# EAGLE design Sheep (EAGLE 7.3.0)
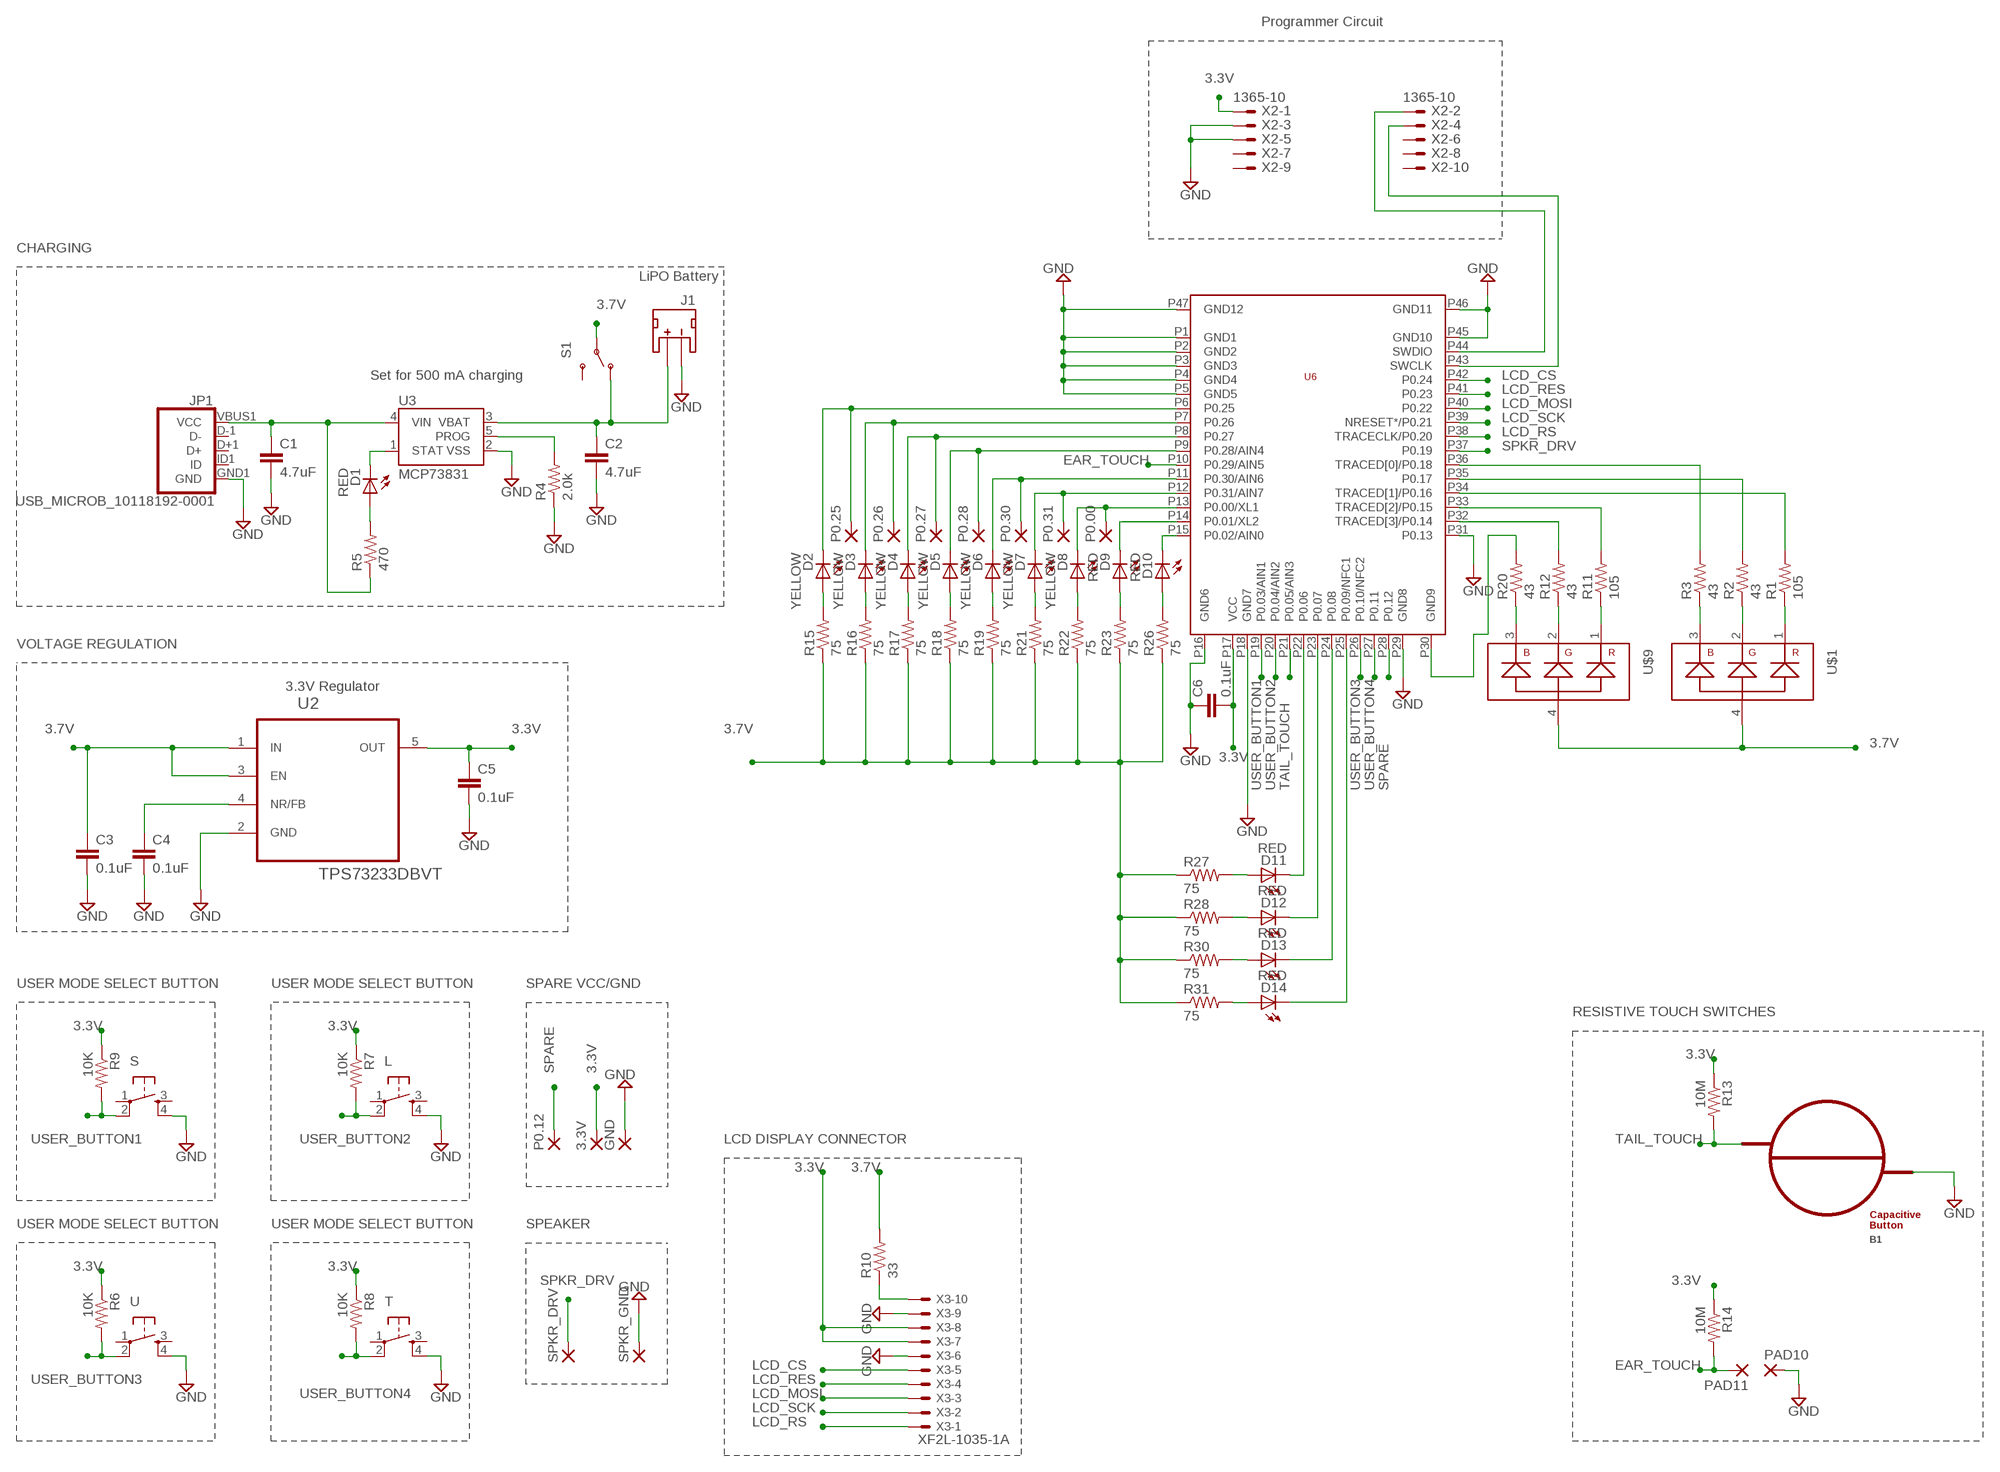
[diagram p0: schematic, sheet 1]

## Parts
3.3V  1,6/0,8  [1,6/0,8]
B1  BUTTON_ACTIVE_DUAL  [BUTTON_ACTIVE_DUAL_10MM]
C1  4.7uF  CAP0603-CAP  [0603-CAP]
C2  4.7uF  CAP0603-CAP  [0603-CAP]
C3  0.1uF  C-EUC0201  [C0201]
C4  0.1uF  C-EUC0201  [C0201]
C5  0.1uF  C-EUC0201  [C0201]
C6  0.1uF  C-EUC0201  [C0201]
D1  RED  LEDCHIP-LED0603  [CHIP-LED0603]
D2  YELLOW  LEDCHIP-LED0603  [CHIP-LED0603]
D3  YELLOW  LEDCHIP-LED0603  [CHIP-LED0603]
D4  YELLOW  LEDCHIP-LED0603  [CHIP-LED0603]
D5  YELLOW  LEDCHIP-LED0603  [CHIP-LED0603]
D6  YELLOW  LEDCHIP-LED0603  [CHIP-LED0603]
D7  YELLOW  LEDCHIP-LED0603  [CHIP-LED0603]
D8  YELLOW  LEDCHIP-LED0603  [CHIP-LED0603]
D9  RED  LEDCHIP-LED0603  [CHIP-LED0603]
D10  RED  LEDCHIP-LED0603  [CHIP-LED0603]
D11  RED  LEDCHIP-LED0603  [CHIP-LED0603]
D12  RED  LEDCHIP-LED0603  [CHIP-LED0603]
D13  RED  LEDCHIP-LED0603  [CHIP-LED0603]
D14  RED  LEDCHIP-LED0603  [CHIP-LED0603]
GND  1,6/0,8  [1,6/0,8]
J1  JST_2MM_MALE  [JST-2-SMD]
JP1  USB_MICROB_10118192-0001  USB_MICROB_PLUGCONN-11752  [USB-B-MICRO-SMD_V03]
L  DTSM-6  [DTSM-6]
P0.00  1,6/0,8  [1,6/0,8]
P0.12  1,6/0,8  [1,6/0,8]
P0.25  1,6/0,8  [1,6/0,8]
P0.26  1,6/0,8  [1,6/0,8]
P0.27  1,6/0,8  [1,6/0,8]
P0.28  1,6/0,8  [1,6/0,8]
P0.30  1,6/0,8  [1,6/0,8]
P0.31  1,6/0,8  [1,6/0,8]
PAD10  SMD5  [SMD2,54-5,08]
PAD11  SMD5  [SMD2,54-5,08]
R1  105  R-US_R0201  [R0201]
R2  43  R-US_R0201  [R0201]
R3  43  R-US_R0201  [R0201]
R4  2.0k  R-US_R0201  [R0201]
R5  470  R-US_R0201  [R0201]
R6  10K  R-US_R0201  [R0201]
R7  10K  R-US_R0201  [R0201]
R8  10K  R-US_R0201  [R0201]
R9  10K  R-US_R0201  [R0201]
R10  33  R-US_R0201  [R0201]
R11  105  R-US_R0201  [R0201]
R12  43  R-US_R0201  [R0201]
R13  10M  R-US_R0201  [R0201]
R14  10M  R-US_R0201  [R0201]
R15  75  R-US_R0201  [R0201]
R16  75  R-US_R0201  [R0201]
R17  75  R-US_R0201  [R0201]
R18  75  R-US_R0201  [R0201]
R19  75  R-US_R0201  [R0201]
R20  43  R-US_R0201  [R0201]
R21  75  R-US_R0201  [R0201]
R22  75  R-US_R0201  [R0201]
R23  75  R-US_R0201  [R0201]
R26  75  R-US_R0201  [R0201]
R27  75  R-US_R0201  [R0201]
R28  75  R-US_R0201  [R0201]
R30  75  R-US_R0201  [R0201]
R31  75  R-US_R0201  [R0201]
S  DTSM-6  [DTSM-6]
S1  SWITCH-SPDTSMD2  [SWITCH-SPDT-SMD]
SPKR_DRV  1,6/0,8  [1,6/0,8]
SPKR_GND  1,6/0,8  [1,6/0,8]
T  DTSM-6  [DTSM-6]
U  DTSM-6  [DTSM-6]
U2  TPS73233DBVT  [SOT95P280X145-5N]
U3  MCP73831  [SOT23-5]
U6  BMD-300  [BMD-300]
U$1  RGB  [0606]
U$9  RGB  [0606]
X2  1365-10  [1365-10]
X3  XF2L-1035-1A  52745-1090  [52745-1090]

## Nets
3.3V: 3.3V.1(P) C5.1 C6.2 R6.1 R7.1 R8.1 R9.1 R13.1 R14.1 U2.5(OUT) U6.P17(VCC) X2.1 X3.7 X3.8
3.7V: C3.1 R10.2 R15.1 R16.1 R17.1 R18.1 R19.1 R21.1 R22.1 R23.1 R26.1 R27.1 R28.1 R30.1 R31.1 S1.2(P) U2.1(IN) U2.3(EN) U$1.4 U$9.4
5.0V: C1.1 JP1.VBUS1(VCC) R5.1 U3.4(VIN)
EAR_TOUCH: PAD11.1(P) R14.2 U6.P10(P0.29/AIN5)
GND: B1.Q1 C1.2 C2.2 C3.2 C4.2 C5.2 C6.1 GND.1(P) J1.1(-) JP1.GND1(GND) L.4 PAD10.1(P) R4.1 S.4 SPKR_GND.1(P) T.4 U2.2(GND) U3.2(VSS) U6.P1(GND1) U6.P2(GND2) U6.P3(GND3) U6.P4(GND4) U6.P5(GND5) U6.P16(GND6) U6.P18(GND7) U6.P29(GND8) U6.P31(P0.13) U6.P45(GND10) U6.P46(GND11) U6.P47(GND12) U.4 X2.3 X2.5 X3.6 X3.9
LCD_CS: U6.P42(P0.24) X3.5
LCD_MOSI: U6.P40(P0.22) X3.3
LCD_RES: U6.P41(P0.23) X3.4
LCD_RS: U6.P38(TRACECLK/P0.20) X3.1
LCD_SCK: U6.P39(NRESET*/P0.21) X3.2
N$2: R2.2 U6.P35(P0.17)
N$3: R3.2 U6.P36(TRACED[0]/P0.18)
N$4: R11.2 U6.P33(TRACED[2]/P0.15)
N$5: D6.C P0.30.1(P) U6.P11(P0.30/AIN6)
N$6: D2.C P0.25.1(P) U6.P6(P0.25)
N$7: U6.P44(SWDIO) X2.2
N$8: R20.2 U6.P30(GND9)
N$9: D11.C U6.P22(P0.06)
N$10: D12.C U6.P23(P0.07)
N$11: U6.P43(SWCLK) X2.4
N$12: R1.2 U6.P34(TRACED[1]/P0.16)
N$15: R1.1 U$1.1
N$16: R2.1 U$1.2
N$17: R3.1 U$1.3
N$18: D3.C P0.26.1(P) U6.P7(P0.26)
N$20: D13.C U6.P24(P0.08)
N$21: D5.C P0.28.1(P) U6.P9(P0.28/AIN4)
N$22: D7.C P0.31.1(P) U6.P12(P0.31/AIN7)
N$23: D8.C P0.00.1(P) U6.P13(P0.00/XL1)
N$24: D9.C U6.P14(P0.01/XL2)
N$25: D10.C U6.P15(P0.02/AIN0)
N$26: D14.C U6.P25(P0.09/NFC1)
N$27: R12.2 U6.P32(TRACED[3]/P0.14)
N$28: R4.2 U3.5(PROG)
N$30: D11.A R27.2
N$31: D12.A R28.2
N$32: D13.A R30.2
N$33: D14.A R31.2
N$34: R10.1 X3.10
N$35: D1.A R5.2
N$36: D1.C U3.1(STAT)
N$39: R11.1 U$9.1
N$41: R12.1 U$9.2
N$42: D2.A R15.2
N$43: D3.A R16.2
N$44: D4.A R17.2
N$45: D5.A R18.2
N$46: D6.A R19.2
N$47: D7.A R21.2
N$48: D8.A R22.2
N$49: C4.1 U2.4(NR/FB)
N$50: D9.A R23.2
N$51: D10.A R26.2
N$64: R20.1 U$9.3
N$67: D4.C P0.27.1(P) U6.P8(P0.27)
SPARE: P0.12.1(P) U6.P28(P0.12)
SPKR_DRV: SPKR_DRV.1(P) U6.P37(P0.19)
TAIL_TOUCH: B1.Q2 R13.2 U6.P21(P0.05/AIN3)
USER_BUTTON1: R9.2 S.2 U6.P19(P0.03/AIN1)
USER_BUTTON2: L.2 R7.2 U6.P20(P0.04/AIN2)
USER_BUTTON3: R6.2 U6.P26(P0.10/NFC2) U.2
USER_BUTTON4: R8.2 T.2 U6.P27(P0.11)
VBAT1: C2.1 J1.2(+) S1.1(O) U3.3(VBAT)
Unconnected: J1.NC1(PAD1) J1.NC2(PAD2) JP1.D+1(D+) JP1.D-1(D-) JP1.ID1(ID) L.1 L.3 S1.3(S) S.1 S.3 T.1 T.3 U.1 U.3 X2.6 X2.7 X2.8 X2.9 X2.10

## Notes on the sheet
- Programmer Circuit
- CHARGING
- LiPO Battery
- Set for 500 mA charging
- VOLTAGE REGULATION
- 3.3V Regulator
- USER MODE SELECT BUTTON | USER MODE SELECT BUTTON | SPARE VCC/GND
- RESISTIVE TOUCH SWITCHES
- LCD DISPLAY CONNECTOR
- USER MODE SELECT BUTTON | USER MODE SELECT BUTTON | SPEAKER

## Library data of the parts
3.3V GND P0.00 P0.12 P0.25-P0.28 P0.30 P0.31 SPKR_DRV SPKR_GND = wirepad:1,6/0,8: THROUGH-HOLE PAD
B1 = PatternAgents-TouchWidgets:BUTTON_ACTIVE_DUAL: Button, Active Capacitive/Touch Sensing Type, Dual Source : http://www.PatternAgents.com Github : https://github.com/PatternAgents License : http://creativecommons.org/licenses/by-sa/3.1/ (Creative Commons 3.1) THIS SOFTWARE IS PROVIDED BY THE CONTRIBUTORS "AS IS" AND WITHOUT ANY EXPRESS OR IMPLIED WARRANTIES, INCLUDING, BUT NOT LIMITED TO, THE IMPLIED WARRANTIES OF MERCHANTABILITY AND FITNESS FOR A PARTICULAR PURPOSE ARE DISCLAIMED. IN NO EVENT SHALL THE COPYRIGHT OWNER OR CONTRIBUTORS BE LIABLE FOR ANY DIRECT, INDIRECT, INCIDENTAL, SPECIAL, EXEMPLARY, OR CONSEQUENTIAL DAMAGES (INCLUDING, BUT NOT LIMITED TO, PROCUREMENT OF SUBSTITUTE GOODS OR SERVICES; LOSS OF USE, DATA, OR PROFITS; OR BUSINESS INTERRUPTION) HOWEVER CAUSED AND ON ANY THEORY OF LIABILITY, WHETHER IN CONTRACT, STRICT LIABILITY, OR TORT (INCLUDING NEGLIGENCE OR OTHERWISE) ARISING IN ANY WAY OUT OF THE USE OF THIS SOFTWARE, EVEN IF ADVISED OF THE POSSIBILITY OF SUCH DAMAGE.
C1 C2 = SparkFun:CAP: Capacitor Standard 0603 ceramic capacitor, and 0.1" leaded capacitor.
C3-C6 = rcl:C-EU: CAPACITOR, European symbol
D1-D14 = led:LED: LED OSRAM: - CHIPLED LG R971, LG N971, LY N971, LG Q971, LY Q971, LO R971, LY R971 LH N974, LH R974 LS Q976, LO Q976, LY Q976 LO Q996 - Hyper CHIPLED LW Q18S LB Q993, LB Q99A, LB R99A - SideLED LS A670, LO A670, LY A670, LG A670, LP A670 LB A673, LV A673, LT A673, LW A673 LH A674 LY A675 LS A676, LA A676, LO A676, LY A676, LW A676 LS A679, LY A679, LG A679 - Hyper Micro SIDELED® LS Y876, LA Y876, LO Y876, LY Y876 LT Y87S - SmartLED LW L88C, LW L88S LB L89C, LB L89S, LG L890 LS L89K, LO L89K, LY L89K LS L896, LA L896, LO L896, LY L896 - TOPLED LS T670, LO T670, LY T670, LG T670, LP T670 LSG T670, LSP T670, LSY T670, LOP T670, LYG T670 LG T671, LOG T671, LSG T671 LB T673, LV T673, LT T673, LW T673 LH T674 LS T676, LA T676, LO T676, LY T676, LB T676, LH T676, LSB T676, LW T676 LB T67C, LV T67C, LT T67C, LS T67K, LO T67K, LY T67K, LW E67C LS E67B, LA E67B, LO E67B, LY E67B, LB E67C, LV E67C, LT E67C LW T67C LS T679, LY T679, LG T679 LS T770, LO T770, LY T770, LG T770, LP T770 LB T773, LV T773, LT T773, LW T773 LH T774 LS E675, LA E675, LY E675, LS T675 LS T776, LA T776, LO T776, LY T776, LB T776 LHGB T686 LT T68C, LB T68C - Hyper Mini TOPLED® LB M676 - Mini TOPLED Santana® LG M470 LS M47K, LO M47K, LY M47K Source: http://www.osram.convergy.de LUXEON: - LUMILED® LXK2-PW12-R00, LXK2-PW12-S00, LXK2-PW14-U00, LXK2-PW14-V00 LXK2-PM12-R00, LXK2-PM12-S00, LXK2-PM14-U00 LXK2-PE12-Q00, LXK2-PE12-R00, LXK2-PE12-S00, LXK2-PE14-T00, LXK2-PE14-U00 LXK2-PB12-K00, LXK2-PB12-L00, LXK2-PB12-M00, LXK2-PB14-N00, LXK2-PB14-P00, LXK2-PB14-Q00 LXK2-PR12-L00, LXK2-PR12-M00, LXK2-PR14-Q00, LXK2-PR14-R00 LXK2-PD12-Q00, LXK2-PD12-R00, LXK2-PD12-S00 LXK2-PH12-R00, LXK2-PH12-S00 LXK2-PL12-P00, LXK2-PL12-Q00, LXK2-PL12-R00 Source: www.luxeon.com KINGBRIGHT: KA-3528ASYC Source: www.kingbright.com
J1 = SparkFun-Connectors:JST_2MM_MALE: Mates to single-cell LiPo batteries. CONN-08352; PROD_ID: CONN-08352
JP1 = SparkFun-Connectors:USB_MICROB_PLUG: USB Micro-B Plug Comes in a variety of packages. Check out Hirose's ZX-x0 line: http://www.hirose.co.jp/cataloge_hp/e24200011.pdf; PROD_ID: CONN-11752
L S T U = switch-tact:DTSM-6
PAD10 PAD11 = wirepad:SMD5: SMD PAD
R1-R23 R26-R28 R30 R31 = rcl:R-US_: RESISTOR, American symbol
S1 = SparkFun-Electromechanical:SWITCH-SPDT: SPDT Switch Simple slide switch, Spark Fun Electronics SKU : COM-00102 DPDT SMT slide switch, AYZ0202, SWCH-08179
U2 = Texas Instruments_By_element14_Batch_1:TPS73233DBVT: Cap-Free, NMOS, 250mA Low Dropout Regulator with Reverse Current Protection; MPN: TPS73233DBVT; OC_FARNELL: -; OC_NEWARK: 87H2968; PACKAGE: SOT-23-5; SUPPLIER: Texas Instruments
U3 = SparkFun:MCP73831: Microchip's MCP73831 Miniature single cell, fully integrated Li-Ion, Li-polymer charge management controller http://ww1.microchip.com/downloads/en/DeviceDoc/21984a.pdf
U6 = BMD-300-Eagle:BMD-300
U$1 U$9 = LITE_ON:RGB
X2 = con-leotronics:1365-10: DUAL ROW STRAIGHT HEADER 1364 SERIES. 1.27mm x 1.27mm. Without Fixing Post. SMT Source: http://www.leotronics.co.uk/Conexcon/Data%20Sheets/sec.%20A/1364ing.pdf; OC_FARNELL: unknown; OC_NEWARK: unknown
X3 = con-molex:52745-1090: FFC/FPC-to-Board 0.50mm (.020") SMT Top Contact Right Angle, ZIF, Style Receptacle 52745 / 52435 Source: http://www.molex.com/product/ffc/52745.html; MPN: 52745-1090; OC_FARNELL: unknown; OC_NEWARK: 92M6380

## Board
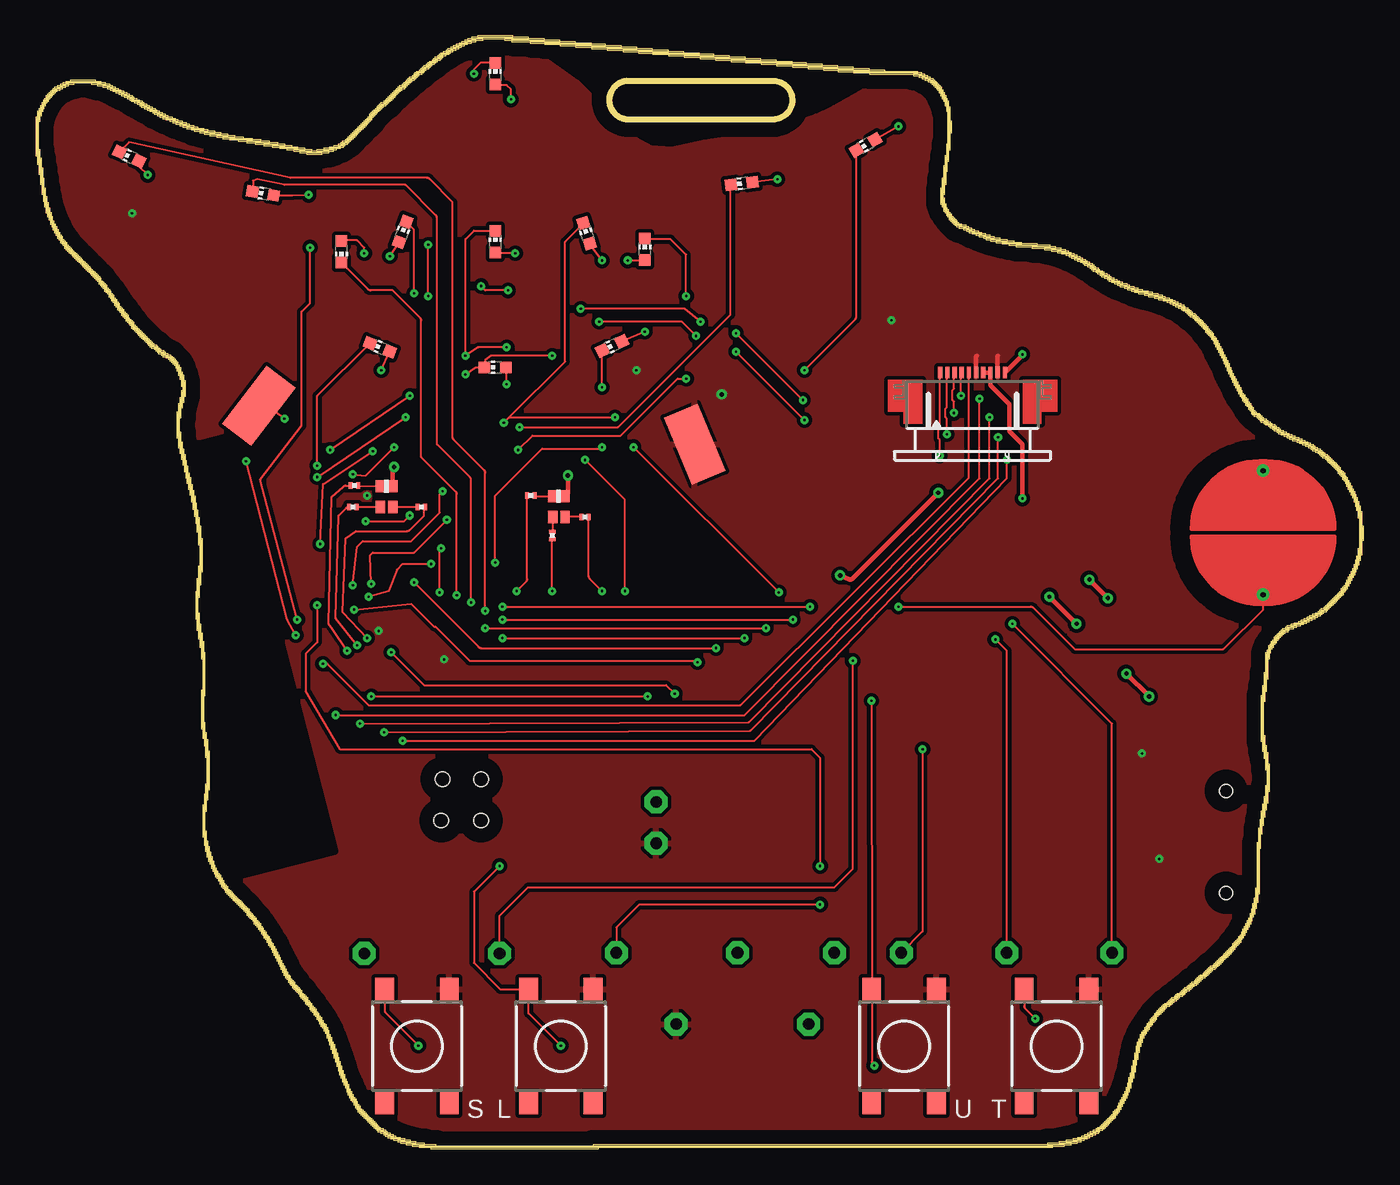
[diagram p1: board, top side]
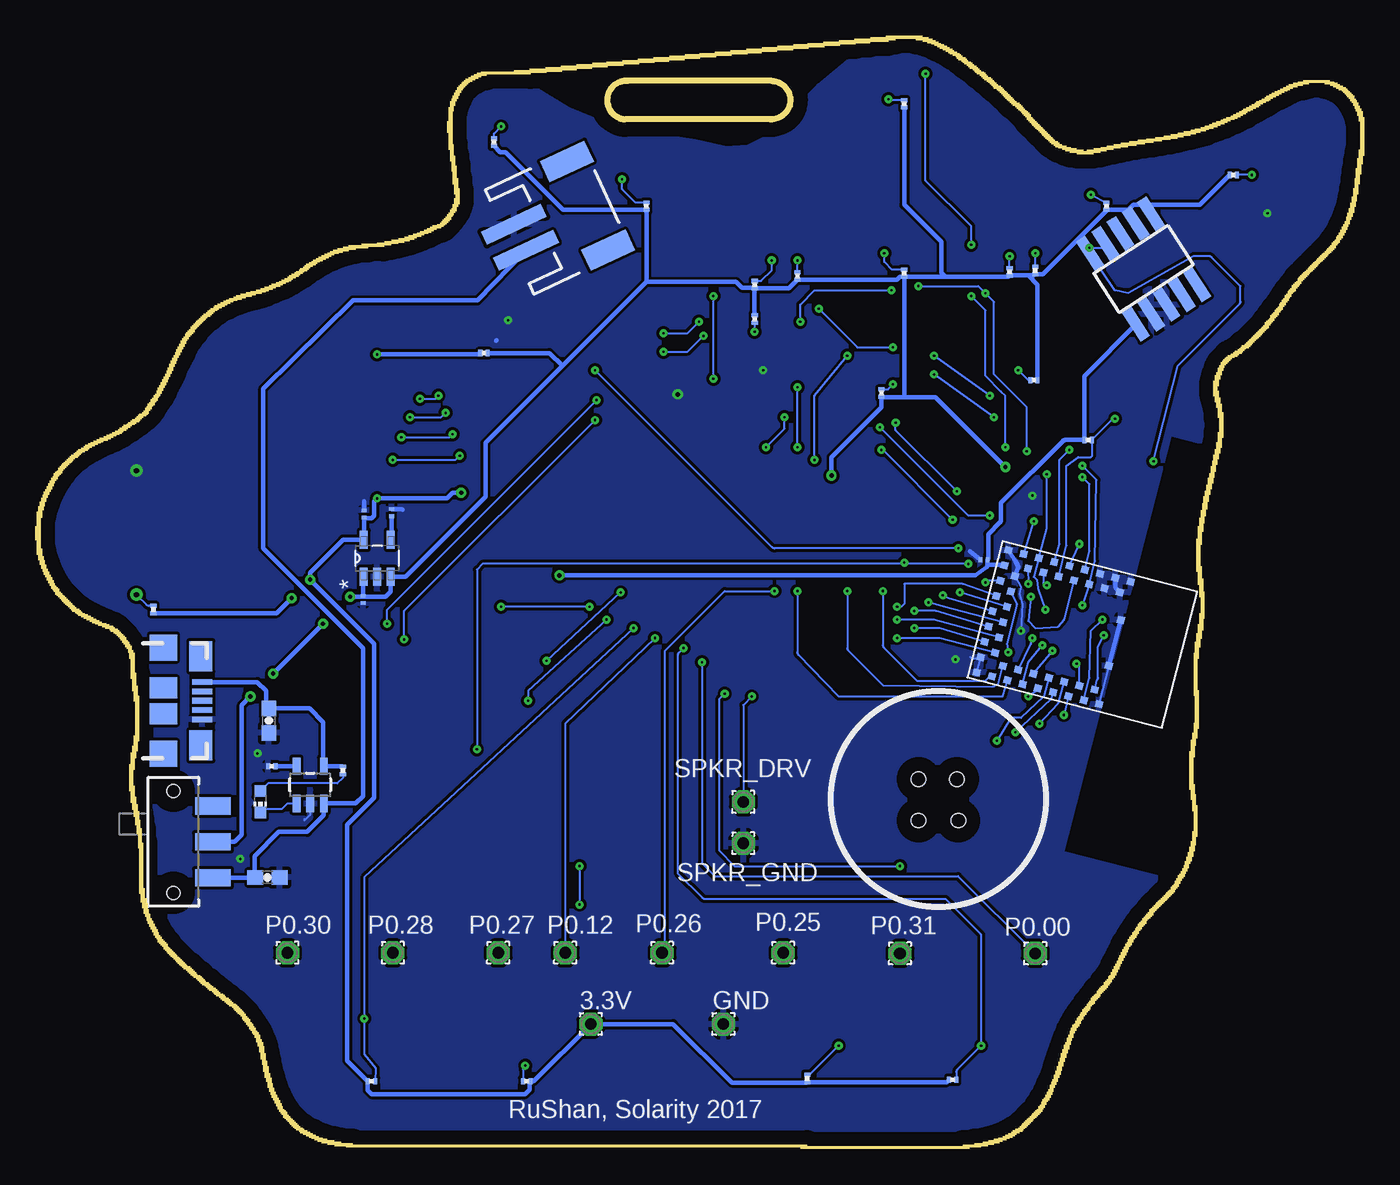
[diagram p2: board, bottom side, seen from below]

Size 92.47 x 77.49 mm. Coordinates in mm from the lower left corner, seen from the top.
Outline: 41.22,74.36 51.24,74.36 arc-180 51.44,71.68 41.32,71.68 arc-180 41.22,74.36
Copper layers (1*16): Top 0.035mm / dielectric 1.5mm / Bottom 0.035mm
Design rules "default": minimum track width 10mil, minimum drill 24mil, track to track 8mil, track to pad 8mil, pad to pad 8mil, via to via 8mil, smd to smd 8mil, copper to edge 40mil, drill to drill 8mil, minimum pad ring 10mil, minimum via ring 8mil, stop-mask expansion 4mil, vias tented up to drill 0mil, thermal gap 10mil
Holes 1 mm at 28.32,25.74 28.23,22.87 31,25.74 31,22.87

### Footprints (pad centres in the part's own frame; a part is rotated, then mirrored left to right if it is on the bottom)
1,6/0,8 = drill 0.813 pad 1.6 octagon: 1 0,0
BUTTON_ACTIVE_DUAL_10MM = drill 0.356: Q1 0,4.318; Q2 0,-4.318
0603-CAP = smd 1.1 x 1: 1 -0.85,0; 2 0.85,0
C0201 = smd 0.25 x 0.35: 1 -0.25,0; 2 0.25,0
CHIP-LED0603 = smd 0.8 x 0.8: A 0,-0.75; C 0,0.75
JST-2-SMD = smd 1 x 4.6: 1 -1,-3.7; 2 1,-3.7 | smd 1.6 x 3.4: NC1 -3.4,1.5; NC2 3.4,1.5
USB-B-MICRO-SMD_V03 = smd 1.4 x 0.4: D+1 2.7,0; D-1 2.7,0.65; GND1 2.7,-1.3; ID1 2.7,-0.65; VBUS1 2.7,1.3 | smd 1.9 x 1.45: P$1 0,-0.9; P$2 0,0.9 | smd 1.9 x 1.8: P$3 0,3.7; P$4 0,-3.7 | smd 1.6 x 2.1: P$5 2.6,3.1; P$6 2.6,-3.1
DTSM-6 = smd 1.55 x 1.3: 1 -3.975,2.25; 2 3.975,2.25; 3 -3.975,-2.25; 4 3.975,-2.25
SMD2,54-5,08 = smd 2.54 x 5.08: 1 0,0
R0201 = smd 0.28 x 0.43: 1 -0.255,0; 2 0.255,0
SWITCH-SPDT-SMD = smd 1.2 x 2.5: 1 -2.5,-2.75; 2 0,-2.75; 3 2.5,-2.75 | hole 0.9: -3.55,0; 3.55,0
SOT95P280X145-5N = smd 1.27 x 0.559: 1 -1.295,0.94; 2 -1.295,0; 3 -1.295,-0.94; 4 1.295,-0.94; 5 1.295,0.94
SOT23-5 = smd 0.55 x 1.2: 1 -0.95,-1.3; 2 0,-1.3; 3 0.95,-1.3; 4 0.95,1.3; 5 -0.95,1.3
BMD-300 = smd 0.5 x 0.5: P1 0.5,9.35; P2 1.4,8.8; P3 0.5,8.25; P4 1.4,7.7; P5 0.5,7.15; P6 1.4,6.6; P7 0.5,6.05; P8 1.4,5.5; P9 0.5,4.95; P10 1.4,4.4; P11 0.5,3.85; P12 1.4,3.3; P13 0.5,2.75; P14 1.4,2.2; P15 0.5,1.65; P16 0.5,0.55; P17 1.6,0.55; P18 2.15,1.45; P19 2.7,0.55; P20 3.25,1.45; P21 3.8,0.55; P22 4.35,1.45; P23 4.9,0.55; P24 5.45,1.45; P25 6,0.55; P26 6.55,1.45; P27 7.1,0.55; P28 7.65,1.45; P29 8.2,0.55; P30 9.3,1.65; P31 9.3,0.55; P32 8.4,2.2; P33 9.3,2.75; P34 8.4,3.3; P35 9.3,3.85; P36 8.4,4.4; P37 9.3,4.95; P38 8.4,5.5; P39 9.3,6.05; P40 8.4,6.6; P41 9.3,7.15; P42 8.4,7.7; P43 9.3,8.25; P44 8.4,8.8; P45 9.3,9.35; P46 6.55,9.35; P47 3.25,9.35
0606 = smd 0.65 x 0.85: 1 0,0; 2 0.85,0; 3 0.85,-1.45; 4 0,-1.45
1365-10 = smd 0.76 x 2.4: 1 -2.54,-2.95; 2 -2.54,2.95; 3 -1.27,-2.95; 4 -1.27,2.95; 5 0,-2.95; 6 0,2.95; 7 1.27,-2.95; 8 1.27,2.95; 9 2.54,-2.95; 10 2.54,2.95
52745-1090 = smd 0.3 x 0.8: 1 -2.25,2.5; 2 -1.75,2.5; 3 -1.25,2.5; 4 -0.75,2.5; 5 -0.25,2.5; 6 0.25,2.5; 7 0.75,2.5; 8 1.25,2.5; 9 1.75,2.5; 10 2.25,2.5

### Placement (x,y rotation side)
3.3V  53.82,8.69 0 bottom
B1  85.47,42.91 0 top
C1  76.24,29.81 270 bottom
C2  76.34,18.9 0 bottom
C3  69.7,38.25 270 bottom
C4  67.71,44.3 90 bottom
C5  69.6,44.2 90 bottom
C6  26.44,41.02 0 bottom
D1  76.84,24.16 180 bottom
D2  23.96,55.81 67.5 top
D3  32,54.42 90 top
D4  40.13,55.91 115 top
D5  25.55,63.84 340 top
D6  32,63.15 0 top
D7  38.34,63.74 17.5 top
D8  32,74.85 0 top
D9  42.41,62.65 0 top
D10  49.16,67.22 97.5 top
D11  57.79,69.89 120 top
D12  21.28,62.45 180 top
D13  15.82,66.52 80 top
D14  6.5,69.1 65 top
GND  44.6,8.69 0 bottom
J1  55.41,65.03 295 bottom
JP1  83.59,31.2 0 bottom
L  36.56,7.16 90 top
P0.00  22.87,13.62 0 bottom
P0.12  55.61,13.66 0 bottom
P0.25  40.43,13.66 0 bottom
P0.26  48.86,13.66 0 bottom
P0.27  60.27,13.66 0 bottom
P0.28  67.61,13.66 0 bottom
P0.30  74.95,13.66 0 bottom
P0.31  32.29,13.62 0 bottom
PAD10  45.88,49.06 22.5 top
PAD11  15.53,51.74 322.5 top
R1  26.84,44.69 0 top
R2  22.07,44.69 180 top
R3  22.17,46.18 180 top
R4  76.05,26.64 0 bottom
R5  71.08,26.34 270 bottom
R6  58.29,4.71 180 bottom
R7  38.74,4.91 90 bottom
R8  69.1,4.71 0 bottom
R9  28.62,4.81 0 bottom
R10  61.26,55.41 0 bottom
R11  38.25,44 0 top
R12  35.96,42.71 270 top
R13  84.28,37.55 90 bottom
R14  19.2,49.36 0 bottom
R15  22.97,53.52 180 bottom
R16  33.58,52.63 90 bottom
R17  42.41,57.79 270 bottom
R18  24.65,61.06 90 bottom
R19  32,60.97 90 bottom
R20  34.48,45.49 180 top
R21  39.44,60.77 90 bottom
R22  32,72.77 90 bottom
R23  42.41,60.17 90 bottom
R26  49.95,65.63 90 bottom
R27  60.57,70.09 90 bottom
R28  22.87,61.16 90 bottom
R30  17.91,65.63 90 bottom
R31  9.08,67.81 0 bottom
S  26.54,7.16 90 top
S1  82.89,21.38 90 bottom
SPKR_DRV  43.21,24.16 0 bottom
SPKR_GND  43.21,21.28 0 bottom
T  71.08,7.16 90 top
U  60.47,7.16 90 top
U2  68.7,41.12 90 bottom
U3  73.37,25.35 0 bottom
U6  25.15,42.31 255.5 bottom
U$1  24.85,44.69 180 top
U$9  36.86,44 180 top
X2  15.33,61.26 33 bottom
X3  65.23,51.54 0 top

### Tracks (layer width: path | path; a pad name or v marks a point on that pad's centre or on a via)
3.3V  (via drill 0.15 pad 0.3, 0.3, 0.3 pad 0.3)
  Top 0.305: v74.66,38.35 | v74.66,38.35 v73.37,39.63 | v56,39.93 56.69,39.63 arc45 56.87,39.71 v62.85,45.69 | v68.7,45.29 68.7,49.06 67.81,49.95 67.81,51.84 66.48,53.17 X3.8 X3.7
  Bottom 0.305: R9.1 29.03,4.66 R7.1 38.78,4.61 44,4.61 48.08,8.69 3.3V.1 57.8,4.71 R6.1 58.09,4.66 58.09,4.12 58.39,3.82 69.1,3.82 69.36,4.07 R8.1 70.79,6.14 70.79,22.57 68.9,24.46 68.9,35.17 v73.37,39.63 73.37,40.13 71.08,42.42 U2.5 69.6,42.47 C5.1 69.55,43.9 69.1,43.9 68.9,44.1 68.9,45.09 v68.7,45.29 63.84,45.29 63.45,45.69 v62.85,45.69 | R13.1 75.71,37.3 v74.66,38.35 | 26.19,40.68 C6.2 arc-45 26.14,41.14 26.14,42.81 25.32,43.63 arc-45 25.25,43.81 25.25,44.99 20.96,49.28 arc45 20.78,49.36 R14.1 19.45,53.7 arc45 19.38,53.88 X2.1 | 26.19,40.68 arc45 26.26,40.51 27.03,39.93 v56,39.93 | 26.19,40.68 25.16,40.68 arc45 U6.P17
3.7V  (via drill 0.3)
  Top 0.305: v77.53,31.5 v75.95,33.09 | v72.47,36.56 v70.59,38.44 | v37.05,46.88 37.05,45.65 U$9.4 | U$1.4 24.85,47.27 24.95,47.37 v24.95,47.47
  Bottom 0.152: R30.1 17.91,65.33
  Bottom 0.305: S1.2 78.62,21.38 78.13,21.88 78.13,30.9 v77.53,31.5 | v75.95,33.09 v72.47,36.56 | v70.59,38.44 69.75,38.44 C3.1 | C3.1 69.7,39.78 U2.1 | 55.81,54.52 61.16,49.16 61.16,45.39 66.73,39.83 U2.3 67.76,38.79 68.11,38.44 69.64,38.44 C3.1 | 55.81,54.52 49.95,60.37 | 49.95,60.37 R26.1 55.75,65.37 59.77,69.4 60.13,69.4 R27.1 | 49.95,60.37 43.7,60.37 43.31,59.97 42.47,59.97 R23.1 | R23.1 R17.1 | R23.1 40.03,59.92 R21.1 32.51,60.51 32.31,60.71 R19.1 | R19.1 29.12,60.71 | 29.12,60.71 24.75,60.71 R18.1 23.36,60.81 | 23.36,60.81 22.97,60.81 R28.1 22.33,60.91 17.91,65.33 | R31.1 11.42,65.73 16.02,65.73 16.38,65.37 R30.1 | 32,52.33 29.81,52.33 v24.95,47.47 | 32,52.33 R19.1 | R15.1 22.71,60.16 23.36,60.81 | R22.1 32,65.73 29.42,63.15 29.42,61.01 29.12,60.71 | R10.2 56.7,55.41 55.81,54.52 | v37.05,46.88 37.05,48.17 33.58,51.64 R16.1 33.54,52.33 32,52.33
5.0V
  Bottom 0.305: JP1.VBUS1 77.05,32.5 76.44,31.9 76.44,30.86 C1.1 73.42,30.66 72.47,29.71 72.47,26.71 U3.4 71.14,26.65 R5.1
EAR_TOUCH  (via drill 0.15)
  Top 0.127: v17.31,50.85 16.22,51.64 PAD11.1
  Bottom 0.127: R14.2 17.45,50.85 v17.31,50.85
  Bottom 0.152: U6.P10 20.68,42.02 20.68,47.57 19.89,48.17 19,48.17 18.9,48.27 18.9,49.32 R14.2
GND  (via drill 0.15, 0.3 pad 0.3)
  Top 0.305: X3.9 66.98,55.18 67.02,55.21 | X3.6 65.48,55.16 65.53,55.21
  Bottom 0.152: U3.2 73.37,23.26 73.76,22.87 73.76,22.97 | 27.41,34.25 arc-45 27.23,34.18 26.84,34.18 | U6.P46 U6.P45 | v23.86,36.06 23.76,37.95 23.96,38.64 23.86,39.14 24.26,39.83 24.06,40.73 U6.P16 | U6.P31 U6.P29
  Bottom 0.305: 60.42,56.25 60.37,56.3 | C5.2 69.6,45.09 | 69.6,45.09 | C4.2 66.97,44.55 66.92,44.5 | U6.P2 17.21,38.99 arc45 17.29,39.17 U6.P3 | U6.P47 U6.P46 | U6.P16 24.26,40.92 24.06,40.53 U6.P18 | C6.1 27.43,41.62
  other vias: 28.42,34.08 78.23,20.19 77.04,27.53 59.58,57.69 6.7,65.13 23.07,45.49 41.82,54.22 47.77,52.53
  pour Bottom: 4.51,73.96 9.08,71.38 13.64,69.99 18.9,69.1 20.88,69.2 22.57,70.49 26.34,74.26 28.72,76.05 30.71,77.04 33.38,77.04 35.86,75.65 37.95,73.96 40.83,71.08 41.72,70.29 42.91,69.7 44.4,69.6 46.58,70.09 49.75,70.59 52.83,71.28 55.31,72.28 57.59,73.66 59.87,74.66 61.36,74.66 62.55,73.86 63.25,72.67 63.35,71.38 63.35,69.89 63.15,68.51 62.85,66.52 62.85,65.53 63.84,64.24 66.62,62.95 69.6,62.55 71.28,62.25 73.37,61.16 75.05,60.07 78.03,59.08 79.91,58.19 81.6,56.6 84.28,51.54 84.88,50.85 86.07,49.95 88.45,48.76 89.54,48.17 90.83,46.68 91.62,45.19 92.02,43.9 92.02,41.32 91.03,39.34 89.84,38.05 89.14,37.45 87.16,36.56 86.76,36.36 86.36,35.96 85.87,35.37 85.57,34.67 85.47,34.28 85.27,31.6 85.17,28.42 85.57,26.34 85.57,25.25 84.97,21.38 84.88,18.11 84.58,16.72 83.78,14.93 82.99,14.04 80.01,11.36 78.53,10.27 77.53,9.28 76.54,7.59 76.14,5.31 75.55,3.42 74.56,2.13 73.27,1.14 70.49,0.45 27.33,0.45 25.35,0.94 24.46,1.34 23.46,2.13 22.37,3.42 20.49,8.38 19.99,9.28 19.2,10.27 18.3,11.36 17.51,12.55 16.82,14.04 15.82,15.63 14.93,16.72 13.64,18.01 12.95,19 12.35,20.29 12.05,21.48 11.95,23.56 12.15,24.95 12.25,25.35 12.25,27.73 11.95,29.12 11.86,31.5 11.95,32 11.95,34.48 11.56,36.96 11.46,38.34 11.66,40.03 11.76,42.31 11.36,44.5 10.66,47.87 10.27,49.65 10.27,51.14 10.66,52.73 10.37,54.52 8.28,56.3 6.99,57.49 5.11,60.07 4.41,60.97 2.03,63.35 1.34,64.83 0.74,67.02 0.54,68.9 0.35,71.38 0.74,72.67 1.64,73.66 2.83,74.16
  pour Top (isolate 0.254): 4.41,73.96 8.28,71.78 9.08,71.38 13.84,69.89 19,69.1 20.78,69.2 21.88,69.89 24.16,72.08 26.44,74.36 28.82,76.14 30.61,77.04 33.28,77.04 34.87,76.24 37.65,74.26 38.74,73.17 41.12,70.79 41.72,70.29 42.81,69.7 44.3,69.6 46.58,70.09 49.85,70.59 51.94,71.08 54.32,71.88 55.61,72.47 57.69,73.66 59.77,74.66 61.36,74.66 62.45,73.96 63.25,72.77 63.35,71.38 63.35,69.89 63.05,67.41 62.85,66.32 62.85,65.43 63.84,64.24 66.62,62.95 69.8,62.55 71.28,62.25 73.47,61.06 74.95,60.17 77.93,59.08 79.91,58.19 81.5,56.7 82.89,54.12 84.28,51.44 85.97,50.05 89.44,48.27 90.83,46.68 91.62,45.19 92.02,44 92.02,41.42 91.03,39.24 89.24,37.55 86.96,36.46 85.97,35.57 85.47,34.18 85.17,29.42 85.17,28.32 85.57,26.44 85.57,25.15 85.07,22.27 84.88,20.09 84.88,18.11 84.68,16.82 83.78,14.93 82.99,14.04 79.62,11.06 78.53,10.27 77.53,9.28 76.54,7.59 76.34,6.5 76.14,5.41 75.55,3.42 74.56,2.13 73.27,1.14 70.59,0.45 27.33,0.45 24.46,1.34 23.36,2.23 22.47,3.32 20.49,8.48 19.99,9.28 19.1,10.37 18.11,11.66 17.41,12.85 16.52,14.53 15.63,15.92 14.53,17.11 13.54,18.2 12.85,19.2 12.35,20.49 12.05,21.38 11.95,23.46 12.25,25.55 12.25,27.63 12.05,29.02 11.86,30.31 11.86,31.7 11.95,32.29 11.95,34.48 11.56,36.86 11.46,38.34 11.66,39.83 11.76,42.21 11.66,43.31 11.46,44.5 11.16,45.79 10.27,49.56 10.27,51.04 10.66,52.63 10.37,54.42 9.77,55.11 6.99,57.49 5.01,60.27 4.51,60.87 2.73,62.65 2.13,63.25 1.34,64.83 0.74,67.02 0.54,69.2 0.35,71.28 0.74,72.67 1.64,73.66 2.83,74.16
LCD_CS  (via drill 0.15)
  Top 0.152: v19.99,33.78 20.29,33.78 23.17,30.9 49.06,30.9 64.93,46.68 64.98,46.73 X3.5
  Bottom 0.152: U6.P42 19.8,33.59 v19.99,33.78
LCD_MOSI  (via drill 0.15, 0.15 pad 0.3)
  Top 0.152: v22.57,29.61 49.65,29.71 66.42,46.68 v66.42,50.95 | v63.94,51.24 63.94,52.04 63.84,52.14 63.84,52.83 63.94,52.93 63.94,54 X3.3
  Bottom 0.152: U6.P40 21.28,31 v22.57,29.61 | v66.42,50.95 64.24,50.95 v63.94,51.24
LCD_RES  (via drill 0.15, 0.15 pad 0.3)
  Top 0.152: v20.88,30.21 49.36,30.21 65.73,46.68 v65.73,52.23 | v64.44,52.43 64.44,54 X3.4
  Bottom 0.152: U6.P41 v20.88,30.21 | v65.73,52.23 64.64,52.23 v64.44,52.43
LCD_RS  (via drill 0.15, 0.15 pad 0.3)
  Top 0.152: v25.55,28.42 50.05,28.42 67.61,46.68 v67.61,47.97 | v62.95,48.27 62.95,49.36 62.85,49.46 62.85,50.05 62.95,50.15 62.95,54.01 X3.1
  Bottom 0.152: U6.P38 22.27,31.5 23.86,30.01 24.55,30.01 v25.55,28.42 | v67.61,47.97 63.25,47.97 v62.95,48.27
LCD_SCK  (via drill 0.15, 0.15 pad 0.3)
  Top 0.152: v24.26,29.02 49.75,29.12 67.02,46.68 v67.02,49.56 | v63.45,49.75 63.45,50.85 63.35,50.95 63.35,51.54 63.45,51.64 63.45,54 X3.2
  Bottom 0.152: U6.P39 21.78,31.3 v24.26,29.02 | v67.02,49.56 63.64,49.56 v63.45,49.75
N$2  (via drill 0.15)
  Top 0.152: R2.2 21.78,44.69 arc45 21.6,44.62 21.08,44.1 20.88,36.96 v22.37,35.07
  Bottom 0.152: U6.P35 23.36,33.88 v22.37,35.07 | v22.37,35.07 arc45 v22.37,35.07
N$3  (via drill 0.15)
  Top 0.152: v21.68,34.67 20.66,36.19 20.39,36.56 20.59,45.39 21.4,46.11 arc-45 21.58,46.18 R3.2
  Bottom 0.152: U6.P36 21.81,34.46 arc45 v21.68,34.67
N$4  (via drill 0.15)
  Top 0.152: v39.44,38.84 38.57,39.7 arc-45 38.5,39.88 R11.2
  Bottom 0.152: v39.44,38.84 39.44,34.58 arc-45 39.36,34.4 36.56,31.5 25.15,31.5 U6.P33
N$5  (via drill 0.15)
  Top 0.152: v20.49,48.66 v26.04,52.43 | D6.C 31.95,63.94 30.51,63.94 29.91,63.35 v29.91,55.21 30.8,55.81 v32.79,55.81 | P0.30.1 74.95,29.61 v68.01,36.56 | v53.43,52.14 v48.76,56.8 | v46.28,57.59 45.19,58.49 v37.95,58.49
  Bottom 0.152: U6.P11 21.18,42.12 21.18,47.97 v20.49,48.66 | v26.04,52.43 v29.91,55.21 | v68.01,36.56 68.01,37.55 v53.43,52.14 | v48.76,56.8 47.08,56.8 v46.28,57.59 | v37.95,58.49 35.27,55.81 v32.79,55.81
N$6  (via drill 0.15)
  Top 0.152: D2.C 19.59,52.42 v19.59,47.57 | v19.59,37.85 19.59,35.27 18.8,34.48 18.8,31.9 21.18,27.83 54.02,27.83 54.62,27.23 v54.62,19.69 | v54.62,17.01 42.02,17.01 40.43,15.43 P0.25.1 | P0.25.1
  Bottom 0.152: v19.59,47.57 18.6,46.58 18.7,40.92 U6.P6 v19.59,37.85 | v54.62,19.69 v54.62,17.01
N$7  (via drill 0.15)
  Top 0.152: v18.11,35.77 17.51,36.86 v14.63,47.87
  Bottom 0.152: U6.P44 18.58,32.63 arc-45 18.5,32.81 18.5,34.97 v18.11,35.77 | v14.63,47.87 12.95,54.52 8.66,58.81 arc-45 8.58,58.99 8.58,60.07 10.59,62.08 arc-45 10.77,62.16 11.86,62.16 16.42,59.58 17.31,59.78 X2.2
N$8  (via drill 0.15)
  Top 0.152: v33.48,38.84 34.15,39.5 arc45 34.22,39.68 R20.2
  Bottom 0.152: v33.48,38.84 33.48,35.08 arc-45 33.41,34.9 31.1,32.59 26.34,32.59 26.03,32.9 U6.P30
N$9  (via drill 0.15)
  Top 0.152: v28.13,38.74 28.13,41.61 arc-45 28.2,41.79 v28.23,41.82 | v53.52,54.22 57.07,57.76 arc45 57.14,57.94 D11.C
  Bottom 0.152: U6.P22 v28.13,38.74 | v28.23,41.82 41.02,41.82 arc45 41.2,41.89 v53.52,54.22
N$10  (via drill 0.15)
  Top 0.152: v29.32,38.54 29.32,45.58 arc45 29.24,45.76 26.84,48.17 26.84,57.69 arc45 26.76,57.87 24.85,59.78 23.31,59.78 arc-45 23.13,59.85 D12.C
  Bottom 0.152: U6.P23 28.92,38.35 v29.32,38.54
N$11  (via drill 0.15)
  Top 0.152: v18.2,36.86 15.63,46.58 18.5,50.35 18.5,58.29 19.1,58.88 v19.1,62.75
  Bottom 0.152: U6.P43 19.54,31.24 19.49,31.3 19.1,32.79 19,36.06 v18.2,36.86 | v19.1,62.75 17.91,62.75 arc45 17.73,62.68 17.51,62.45 17.51,62.13 arc-45 17.44,61.95 X2.4
N$12  (via drill 0.15)
  Top 0.152: R1.2 arc45 27.03,44.56 27.03,44.1 26.02,43.08 arc-45 25.84,43.01 22.27,43.01 21.58,42.51 21.38,37.35 v23.07,35.57
  Bottom 0.152: U6.P34 23.16,35.16 arc45 23.09,35.34 v23.07,35.57
N$15
  Top 0.152: U$1.1 R1.1
N$16
  Top 0.152: R2.1 U$1.2
N$17
  Top 0.152: R3.1 U$1.3
N$18  (via drill 0.15)
  Top 0.152: v19.59,46.78 v25.74,50.95 | v29.91,53.92 30.61,54.42 D3.C 31.3,54.47 31.3,54.91 31.7,55.21 v35.96,55.21 | v41.02,38.84 41.02,45.19 v38.25,47.97
  Bottom 0.152: U6.P7 19.1,41.62 19.1,46.28 v19.59,46.78 | v25.74,50.95 v29.91,53.92 | P0.26.1 48.66,13.85 48.66,34.67 44.5,38.84 v41.02,38.84 | v38.25,47.97 38.25,52.43 v35.96,55.21
N$20  (via drill 0.15)
  Top 0.152: v30.31,38.05 30.31,46.57 arc45 30.23,46.75 27.93,49.06 27.93,64.83 arc45 27.85,65.01 25.74,67.12 17.31,67.12 15.43,67.51 15.13,67.41 D13.C
  Bottom 0.152: U6.P24 29.22,37.75 v30.31,38.05
N$21  (via drill 0.15)
  Top 0.152: v19.79,42.12 19.99,46.28 v23.46,48.56 | v26.34,59.58 26.34,64.01 D5.C | P0.28.1 67.61,34.67 v66.82,35.47 | v53.52,50.75 | v53.52,50.75 v48.76,55.51 | v45.98,56.6 44.99,57.59 v39.24,57.59 | v32.89,59.78 31.3,59.78 v31,60.07
  Bottom 0.152: U6.P9 v19.79,42.12 | v23.46,48.56 23.46,51.64 25.74,53.92 25.74,58.98 v26.34,59.58 26.84,60.07 v31,60.07 | v66.82,35.47 66.82,37.45 v53.52,50.75 | v48.76,55.51 47.08,55.51 v45.98,56.6 | v39.24,57.59 39.24,58.78 38.25,59.78 v32.89,59.78
N$22  (via drill 0.15)
  Top 0.152: v22.07,39.24 22.37,41.92 22.77,42.31 26.14,42.31 28.13,44.3 28.13,45.59 v28.32,45.79 | v32.59,50.55 32.94,50.9 | 32.94,50.9 36.86,54.81 36.86,63.15 38.12,64.41 D7.C | P0.31.1 32.29,16.22 34.28,18.21 55.61,18.21 56.9,19.49 v56.9,33.98 | v51.74,38.74 v41.62,48.86 | v40.33,50.95 40.28,50.9 32.94,50.9
  Bottom 0.152: U6.P12 22.31,39.4 v22.07,39.24 | v28.32,45.79 32.59,50.05 v32.59,50.55 | v56.9,33.98 v51.74,38.74 | v41.62,48.86 40.33,50.15 v40.33,50.95
N$23  (via drill 0.15)
  Top 0.152: v22.07,46.98 22.97,46.88 v24.95,48.86 | v27.33,59.38 v27.33,62.95 | v30.51,74.86 30.51,75.15 31,75.65 31.95,75.65 D8.C | v22.17,37.55 26.14,37.95 27.73,36.36 27.83,36.36 30.21,33.98 45.98,33.98 v46.08,33.88
  Bottom 0.152: v22.07,46.98 22.07,43.21 U6.P13 22.97,39.83 22.77,39.63 22.67,39.04 v22.17,37.55 | v24.95,48.86 24.95,52.43 25.25,52.73 | 25.25,52.73 | 25.25,52.73 26.34,53.82 26.34,58.39 v27.33,59.38 | v27.33,62.95 27.33,64.24 30.51,67.41 v30.51,74.86 | v46.08,33.88 46.08,19.89 45.19,19 28.25,19 P0.00.1
N$24  (via drill 0.15)
  Top 0.152: v23.36,39.34 23.26,41.32 23.46,41.52 26.34,41.52 v28.62,43.8 | v33.58,48.66 34.57,49.66 40.73,49.66 44.69,53.62 v45.29,53.62 | v45.29,59.38 45.29,62.26 44.2,63.35 42.47,63.35 D9.C
  Bottom 0.152: U6.P14 v23.36,39.34 | v28.62,43.8 33.48,48.66 v33.58,48.66 | v45.29,53.62 v45.29,59.38
N$25  (via drill 0.15)
  Top 0.152: v22.97,43.7 25.65,43.7 v26.04,44.1 | v33.68,50.25 40.53,50.25 48.37,58.09 48.37,67.07 D10.C
  Bottom 0.152: U6.P15 v22.97,43.7 | v26.04,44.1 27.53,44.1 v33.68,50.25
N$26  (via drill 0.15)
  Top 0.152: v31.3,37.45 31.3,47.07 arc45 31.23,47.25 29.09,49.38 arc-45 29.02,49.56 29.02,65.93 27.41,67.54 arc45 27.23,67.61 17.71,67.61 6.5,70.09 D14.C
  Bottom 0.152: U6.P25 29.81,37.45 v31.3,37.45
N$27  (via drill 0.15)
  Top 0.152: v35.96,38.84 arc45 v35.96,38.84 | v35.96,38.84 R12.2
  Bottom 0.152: v35.96,38.84 35.96,34.88 arc-45 35.89,34.7 33.48,32.29 25.85,32.19 arc-45 25.67,32.27 25.45,32.39 25.15,33.5 arc45 25.08,33.58 U6.P32
N$28
  Bottom 0.305: U3.5 75.78,26.65 R4.2
N$30  (via drill 0.15)
  Top 0.152: v60.07,71.18 D11.A
  Bottom 0.152: R27.2 60.57,70.69 v60.07,71.18
N$31  (via drill 0.15)
  Top 0.152: v22.87,62.35 22.87,62.75 22.37,63.25 21.32,63.25 D12.A
  Bottom 0.152: R28.2 v22.87,62.35
N$32  (via drill 0.15)
  Top 0.152: D13.A 17.88,66.39 v19,66.42
  Bottom 0.152: v19,66.42 R30.2
N$33  (via drill 0.15)
  Top 0.152: D14.A 7.18,68.42 v7.79,67.81
  Bottom 0.152: v7.79,67.81 R31.2 | R31.2
N$34  (via drill 0.15 pad 0.3)
  Top 0.305: v68.7,55.31 68.7,55.26 X3.10
  Bottom 0.305: R10.1 61.62,55.31 v68.7,55.31
N$35
  Bottom 0.152: R5.2 71.08,25.84 71.48,25.45 76.3,25.45 D1.A
N$36
  Bottom 0.152: U3.1 74.96,24.05 75.35,23.66 76.59,23.66 D1.C
N$39
  Top 0.152: R11.1 arc45 R11.1 | R11.1 U$9.1
N$41
  Top 0.152: R12.1 arc45 36.01,43.07 U$9.2
N$42  (via drill 0.15)
  Top 0.152: v24.06,54.22 D2.A
  Bottom 0.152: R15.2 23.36,53.52 v24.06,54.22
N$43  (via drill 0.15)
  Top 0.152: v32.79,53.23 32.79,54.37 D3.A
  Bottom 0.152: R16.2 33.13,52.89 v32.79,53.23
N$44  (via drill 0.15)
  Top 0.152: v42.41,56.9 D4.A
  Bottom 0.152: R17.2 v42.41,56.9
N$45  (via drill 0.15)
  Top 0.152: v24.65,62.16 D5.A
  Bottom 0.152: R18.2 v24.65,62.16
N$46  (via drill 0.15)
  Top 0.152: v33.38,62.35 32.04,62.35 D6.A
  Bottom 0.152: R19.2 32.85,61.22 33.38,61.76 v33.38,62.35
N$47  (via drill 0.15)
  Top 0.152: v39.44,61.86 D7.A
  Bottom 0.152: R21.2 v39.44,61.86
N$48  (via drill 0.15)
  Top 0.152: v33.09,73.07 33.09,73.76 32.79,74.06 32.04,74.06 D8.A
  Bottom 0.152: R22.2 33.04,73.03 v33.09,73.07
N$49
  Bottom 0.305: C4.1 67.71,42.47 U2.4
N$50  (via drill 0.15)
  Top 0.152: v41.22,61.86 42.37,61.86 D9.A
  Bottom 0.152: R23.2 41.96,60.43 41.22,61.16 v41.22,61.86
N$51  (via drill 0.15)
  Top 0.152: v51.64,67.51 D10.A
  Bottom 0.152: R26.2 50.7,65.88 51.64,66.82 v51.64,67.51
N$64
  Top 0.152: R20.1 arc45 34.82,45.45 U$9.3
N$67  (via drill 0.15)
  Top 0.152: v27.53,40.73 25.55,40.73 25.15,40.33 24.55,38.84 v23.17,38.44 | v32,40.83 32,45.49 35.27,48.76 39.34,48.76 v39.44,48.86 | v39.44,53.03 39.44,55.57 D4.C | v61.76,27.83 61.76,15.14 P0.27.1
  Bottom 0.152: U6.P8 20.88,36.86 21.28,36.36 22.87,36.26 23.36,36.76 v23.17,38.44 | v27.53,40.73 31.9,40.73 v32,40.83 32.09,40.73 61.36,40.73 61.76,40.33 v61.76,27.83 | v39.44,48.86 v39.44,53.03
SPARE  (via drill 0.15)
  Top 0.152: v32.49,35.57 v49.36,35.57
  Bottom 0.152: U6.P28 29.51,35.57 v32.49,35.57 | v49.36,35.57 55.61,29.61 P0.12.1
SPKR_DRV  (via drill 0.15)
  Top 0.152: v23.36,31.5 v42.61,31.5
  Bottom 0.152: U6.P37 arc45 22.75,31.91 v23.36,31.5 | v42.61,31.5 43.21,30.9 SPKR_DRV.1
TAIL_TOUCH  (via drill 0.15)
  Top 0.152: v60.07,37.75 69.29,37.75 arc-45 69.47,37.68 72.37,34.77 82.59,34.77 arc45 82.77,34.85 85.47,37.55 B1.Q2 | B1.Q2 arc45 B1.Q2 | v32.49,37.75 v53.92,37.75
  Bottom 0.152: U6.P21 27.93,39.34 32,39.34 32,37.95 32.19,37.75 v32.49,37.75 | R13.2 84.58,37.81 arc45 84.76,37.88 B1.Q2 | v53.92,37.75 v60.07,37.75
USER_BUTTON1  (via drill 0.15)
  Top 0.152: v26.34,39.44 30.83,34.95 arc45 31.01,34.87 v47.37,34.87 | S.2 24.29,9.65 arc45 24.36,9.47 v26.64,7.19
  Bottom 0.152: U6.P19 26.11,39.56 arc-45 26.29,39.49 v26.34,39.44 | v47.37,34.87 47.7,34.55 arc-45 47.77,34.37 47.77,19.2 46.06,17.49 arc-45 45.88,17.41 29.12,17.41 26.71,15.01 arc45 26.64,14.83 v26.64,7.19 28.29,5.54 arc-45 28.37,5.36 R9.2
USER_BUTTON2  (via drill 0.15)
  Top 0.152: v36.56,7.19 34.31,9.44 L.2 32.32,11.13 30.51,12.95 30.51,17.91 v32.29,19.69 | v24.75,34.58 27.03,32.29 43.9,32.29 v44.5,31.7
  Bottom 0.152: R7.2 38.59,5.17 v36.56,7.19 | U6.P20 24.16,37.91 24.85,35.17 v24.75,34.58 | v44.5,31.7 44.89,31.3 44.89,20.78 43.8,19.69 v32.29,19.69
USER_BUTTON3  (via drill 0.15)
  Top 0.152: v32.49,36.86 v52.73,36.86 | v58.19,31.2 U.2 58.22,6.08 arc45 58.29,5.9 v58.39,5.8
  Bottom 0.152: U6.P26 29.91,36.86 v32.49,36.86 | v52.73,36.86 58.19,31.9 v58.19,31.2 | v58.39,5.8 58.47,5.72 arc-45 58.54,5.54 R6.2
USER_BUTTON4  (via drill 0.15)
  Top 0.152: v31.3,36.26 v50.85,36.26 | T.2 68.83,9.94 arc45 68.91,9.76 v69.6,9.08
  Bottom 0.152: U6.P27 29.51,36.26 v31.3,36.26 | v50.85,36.26 69.6,18.9 v69.6,9.08 69.6,6.6 68.8,5.61 R8.2
VBAT1
  Bottom 0.305: S1.1 77.21,18.88 C2.1 77.24,18.94 77.24,20.39 75.55,22.07 73.57,22.07 72.42,23.22 U3.3 72.41,24.06 70.19,24.06 69.7,24.55 69.7,34.87 76.63,41.81 76.63,52.94 70.39,59.08 61.72,59.08 J1.2

### Text on the board
_bsilk: RuShan, Solarity 2017